# Altium schematic sheet Connector.SchDoc
size A3; SheetNumber: 5; SheetTotal: 5
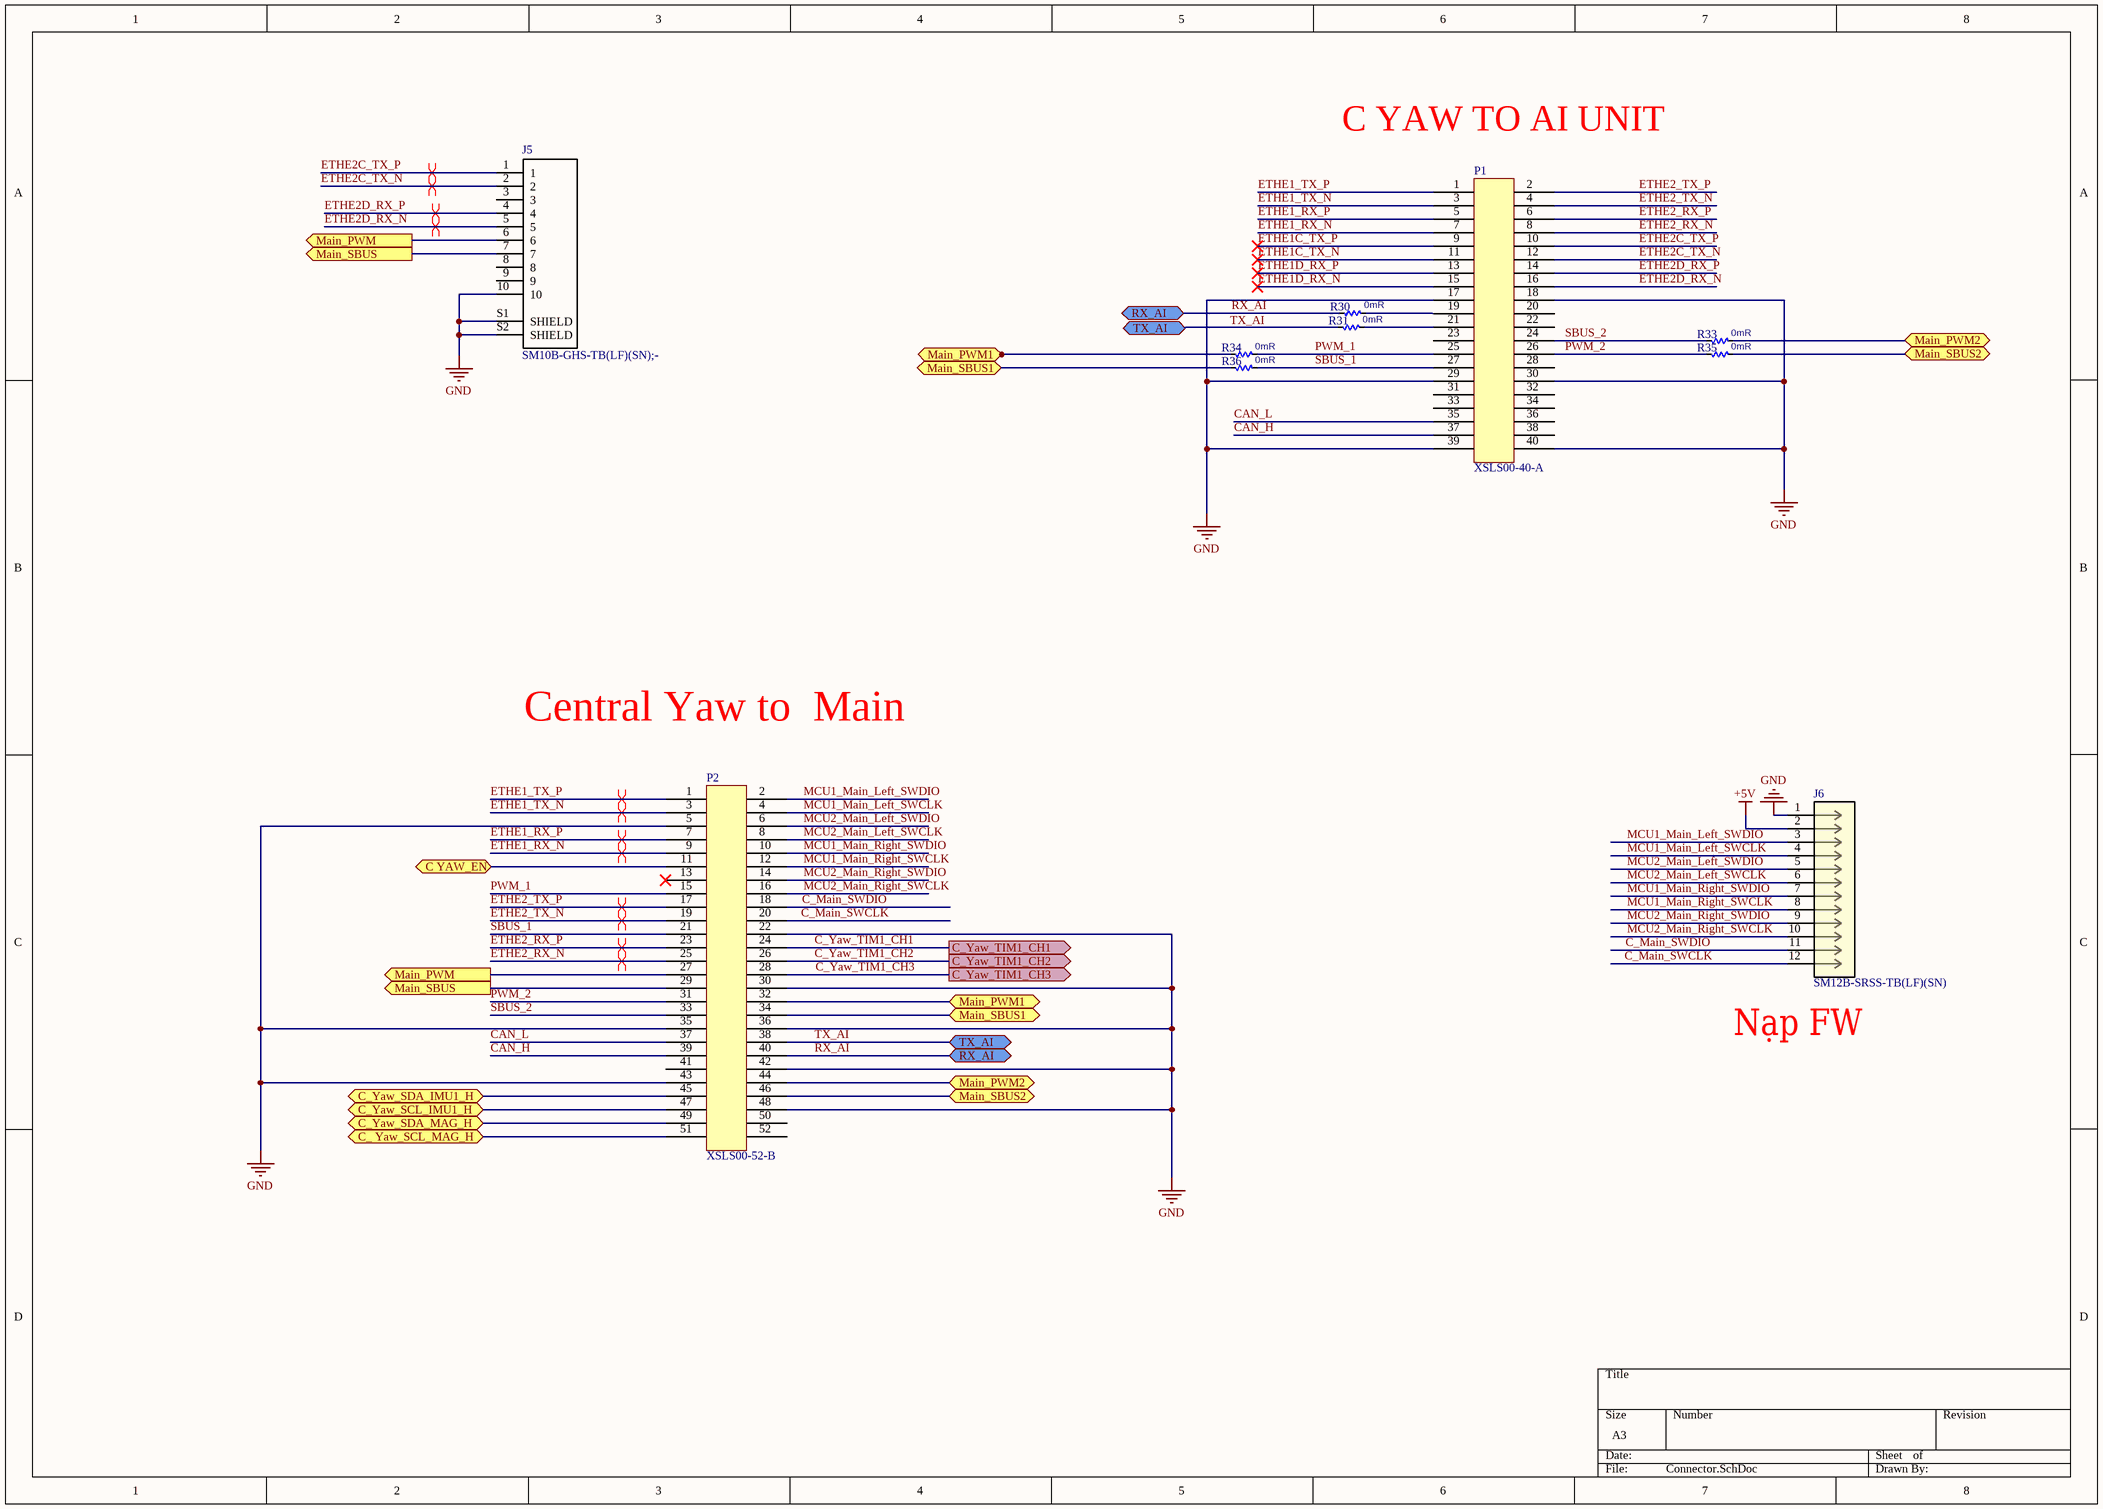
[diagram p0: Connector.SchDoc]

## Parts
J5  SM10B-GHS-TB(LF)(SN);-  [SM10B-GHS-TB(LF)(SN)]
J6  SM12B-SRSS-TB(LF)(SN)  [CONN_SM12B-SRSS-TBLFSN_JST]
P1  XSLS00-40-A  [XSXL40]
P2  XSLS00-52-B  [XSXL52]
R30  value 0mR  [RES0402]  (hidden comment: RES0402)
R31  value 0mR  [RES0402]  (hidden comment: RES0402)
R33  value 0mR  [RES0402]  (hidden comment: RES0402)
R34  value 0mR  [RES0402]  (hidden comment: RES0402)
R35  value 0mR  [RES0402]  (hidden comment: RES0402)
R36  value 0mR  [RES0402]  (hidden comment: RES0402)

## Ports
C YAW_EN (bidir), C_ Yaw_SCL_MAG_H (bidir), C_Yaw_SCL_IMU1_H (bidir), C_Yaw_SDA_IMU1_H (bidir), C_Yaw_SDA_MAG_H (bidir), C_Yaw_TIM1_CH1 (out), C_Yaw_TIM1_CH2 (out), C_Yaw_TIM1_CH3 (out), Main_PWM1 (bidir), Main_PWM2 (bidir), Main_PWM (out), Main_SBUS1 (bidir), Main_SBUS2 (bidir), Main_SBUS (out), RX_AI (bidir), TX_AI (bidir)

## Nets
+5V: J6.2
GND: J5.10 J5.S1(SHIELD) J5.S2(SHIELD) J6.1 P1.17 P1.18 P1.29 P1.30 P1.39 P1.40 P2.5 P2.22 P2.30 P2.35 P2.36 P2.42 P2.43 P2.48
C YAW_EN: P2.11 ; port C YAW_EN
C_ Yaw_SCL_MAG_H: P2.51 ; port C_ Yaw_SCL_MAG_H
C_Main_SWCLK: J6.12 P2.20
C_Main_SWDIO: J6.11 P2.18
C_Yaw_SCL_IMU1_H: P2.47 ; port C_Yaw_SCL_IMU1_H
C_Yaw_SDA_IMU1_H: P2.45 ; port C_Yaw_SDA_IMU1_H
C_Yaw_SDA_MAG_H: P2.49 ; port C_Yaw_SDA_MAG_H
C_Yaw_TIM1_CH1: P2.24 ; port C_Yaw_TIM1_CH1
C_Yaw_TIM1_CH2: P2.26 ; port C_Yaw_TIM1_CH2
C_Yaw_TIM1_CH3: P2.28 ; port C_Yaw_TIM1_CH3
CAN_H: P1.37 P2.39
CAN_L: P1.35 P2.37
ETHE1_RX_N: P1.7 P2.9
ETHE1_RX_P: P1.5 P2.7
ETHE1_TX_N: P1.3 P2.3
ETHE1_TX_P: P1.1 P2.1
ETHE1C_TX_N: P1.11
ETHE1C_TX_P: P1.9
ETHE1D_RX_N: P1.15
ETHE1D_RX_P: P1.13
ETHE2_RX_N: P1.8 P2.25
ETHE2_RX_P: P1.6 P2.23
ETHE2_TX_N: P1.4 P2.19
ETHE2_TX_P: P1.2 P2.17
ETHE2C_TX_N: J5.2 P1.12
ETHE2C_TX_P: J5.1 P1.10
ETHE2D_RX_N: J5.5 P1.16
ETHE2D_RX_P: J5.4 P1.14
Main_PWM: J5.6 P2.27 ; port Main_PWM
Main_PWM1: P2.32 R34.1 ; port Main_PWM1
Main_PWM2: P2.44 R33.2 ; port Main_PWM2
Main_SBUS: J5.7 P2.29 ; port Main_SBUS
Main_SBUS1: P2.34 R36.1 ; port Main_SBUS1
Main_SBUS2: P2.46 R35.2 ; port Main_SBUS2
MCU1_Main_Left_SWCLK: J6.4 P2.4
MCU1_Main_Left_SWDIO: J6.3 P2.2
MCU1_Main_Right_SWCLK: J6.8 P2.12
MCU1_Main_Right_SWDIO: J6.7 P2.10
MCU2_Main_Left_SWCLK: J6.6 P2.8
MCU2_Main_Left_SWDIO: J6.5 P2.6
MCU2_Main_Right_SWCLK: J6.10 P2.16
MCU2_Main_Right_SWDIO: J6.9 P2.14
PWM_1: P1.25 P2.15 R34.2
PWM_2: P1.26 P2.31 R35.1
RX_AI: P2.40 R30.1 ; port RX_AI
SBUS_1: P1.27 P2.21 R36.2
SBUS_2: P1.24 P2.33 R33.1
TX_AI: P2.38 R31.1 ; port TX_AI
NetP1_19: P1.19 R30.2
NetP1_21: P1.21 R31.2

Not connected (* = marked no-connect by the designer): J5 3 8 9; P1 20 22 23 28 31 32 33 34 36 38; P2 13* 41 50 52

## Layout directives
differential pair: ETHE1_RX_N, ETHE1_RX_P, ETHE1_TX_N, ETHE1_TX_P, ETHE2_RX_N, ETHE2_RX_P, ETHE2_TX_N, ETHE2_TX_P, ETHE2C_TX_N, ETHE2C_TX_P, ETHE2D_RX_N, ETHE2D_RX_P

## Notes on the sheet
- (near P1) C YAW TO AI UNIT
- Central Yaw to  Main
- (near J6) Nạp FW
- Labels drawn without touching a wire or pin: TX_AI

## Library data of the parts
J5 = SM10B-GHS-TB(LF)(SN);-: CONN HEADER GH SIDE 10POS 1.25MM; Manufacturer: JST; Number of Positions: 10; Connector Type: Male Pin; Pitch: 0.049inch; Supplier 1: Digi-Key; Supplier Part Number 1: 455-1572-2-ND; Manufacturer Part Number: SM10B-GHS-TB(LF)(SN);-; Stock 1: 0; RoHS: Yes; Mount: Surface Mount; Color: Natural; Contact Plating: Tin; Number of Rows: 1; Fastening Type: Latch; Packaging: Tape and Reel; Termination: Solder; Package Quantity: 1; ComponentLink1URL: http://www.jst-mfg.com/product/pdf/eng/eGH.pdf?src-supplier=Digi-Key; ComponentLink1Description: http://www.jst-mfg.com/product/pdf/eng/eGH.pdf?src-supplier=Digi-Key
J6 = SM12B-SRSS-TBLFSN: Description; Manufacturer_Name: JST; Copyright: Copyright (C) 2025 Ultra Librarian. All rights reserved.; Manufacturer_Part_Number: SM12B-SRSS-TB(LF)(SN); RefDes: RefDes; Type: Type
R30 R31 R33-R36 = RES0402: RES 0402; MP: add later